# EAGLE schematic ESP32 Rev1 (EAGLE 7.7.0)
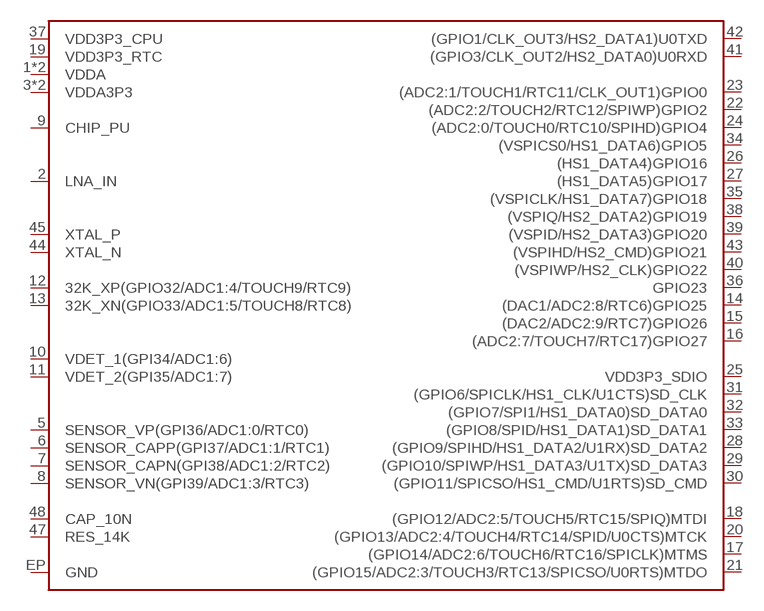
[diagram p0: schematic, sheet 1]

## Parts
U$1  ESP32  [QFN48-0.4MM]
Unconnected: U$1.1(VDDA) U$1.2(LNA_IN) U$1.3(VDDA3P3) U$1.4(VDDA3P3) U$1.5(SENSOR_VP(GPI36/ADC1:0/RTC0)) U$1.6(SENSOR_CAPP(GPI37/ADC1:1/RTC1)) U$1.7(SENSOR_CAPN(GPI38/ADC1:2/RTC2)) U$1.8(SENSOR_VN(GPI39/ADC1:3/RTC3)) U$1.9(CHIP_PU) U$1.10(VDET_1(GPI34/ADC1:6)) U$1.11(VDET_2(GPI35/ADC1:7)) U$1.12(32K_XP(GPIO32/ADC1:4/TOUCH9/RTC9)) U$1.13(32K_XN(GPIO33/ADC1:5/TOUCH8/RTC8)) U$1.14((DAC1/ADC2:8/RTC6)GPIO25) U$1.15((DAC2/ADC2:9/RTC7)GPIO26) U$1.16((ADC2:7/TOUCH7/RTC17)GPIO27) U$1.17((GPIO14/ADC2:6/TOUCH6/RTC16/SPICLK)MTMS) U$1.18((GPIO12/ADC2:5/TOUCH5/RTC15/SPIQ)MTDI) U$1.19(VDD3P3_RTC) U$1.20((GPIO13/ADC2:4/TOUCH4/RTC14/SPID/U0CTS)MTCK) U$1.21((GPIO15/ADC2:3/TOUCH3/RTC13/SPICSO/U0RTS)MTDO) U$1.22((ADC2:2/TOUCH2/RTC12/SPIWP)GPIO2) U$1.23((ADC2:1/TOUCH1/RTC11/CLK_OUT1)GPIO0) U$1.24((ADC2:0/TOUCH0/RTC10/SPIHD)GPIO4) U$1.25(VDD3P3_SDIO) U$1.26((HS1_DATA4)GPIO16) U$1.27((HS1_DATA5)GPIO17) U$1.28((GPIO9/SPIHD/HS1_DATA2/U1RX)SD_DATA2) U$1.29((GPIO10/SPIWP/HS1_DATA3/U1TX)SD_DATA3) U$1.30((GPIO11/SPICSO/HS1_CMD/U1RTS)SD_CMD) U$1.31((GPIO6/SPICLK/HS1_CLK/U1CTS)SD_CLK) U$1.32((GPIO7/SPI1/HS1_DATA0)SD_DATA0) U$1.33((GPIO8/SPID/HS1_DATA1)SD_DATA1) U$1.34((VSPICS0/HS1_DATA6)GPIO5) U$1.35((VSPICLK/HS1_DATA7)GPIO18) U$1.36(GPIO23) U$1.37(VDD3P3_CPU) U$1.38((VSPIQ/HS2_DATA2)GPIO19) U$1.39((VSPID/HS2_DATA3)GPIO20) U$1.40((VSPIWP/HS2_CLK)GPIO22) U$1.41((GPIO3/CLK_OUT2/HS2_DATA0)U0RXD) U$1.42((GPIO1/CLK_OUT3/HS2_DATA1)U0TXD) U$1.43((VSPIHD/HS2_CMD)GPIO21) U$1.44(XTAL_N) U$1.45(XTAL_P) U$1.46(VDDA) U$1.47(RES_14K) U$1.48(CAP_10N) U$1.EP(GND)

## Library data of the parts
U$1 = dr-library:ESP32